# Altium schematic sheet STM32智能储物柜.SchDoc
size A4
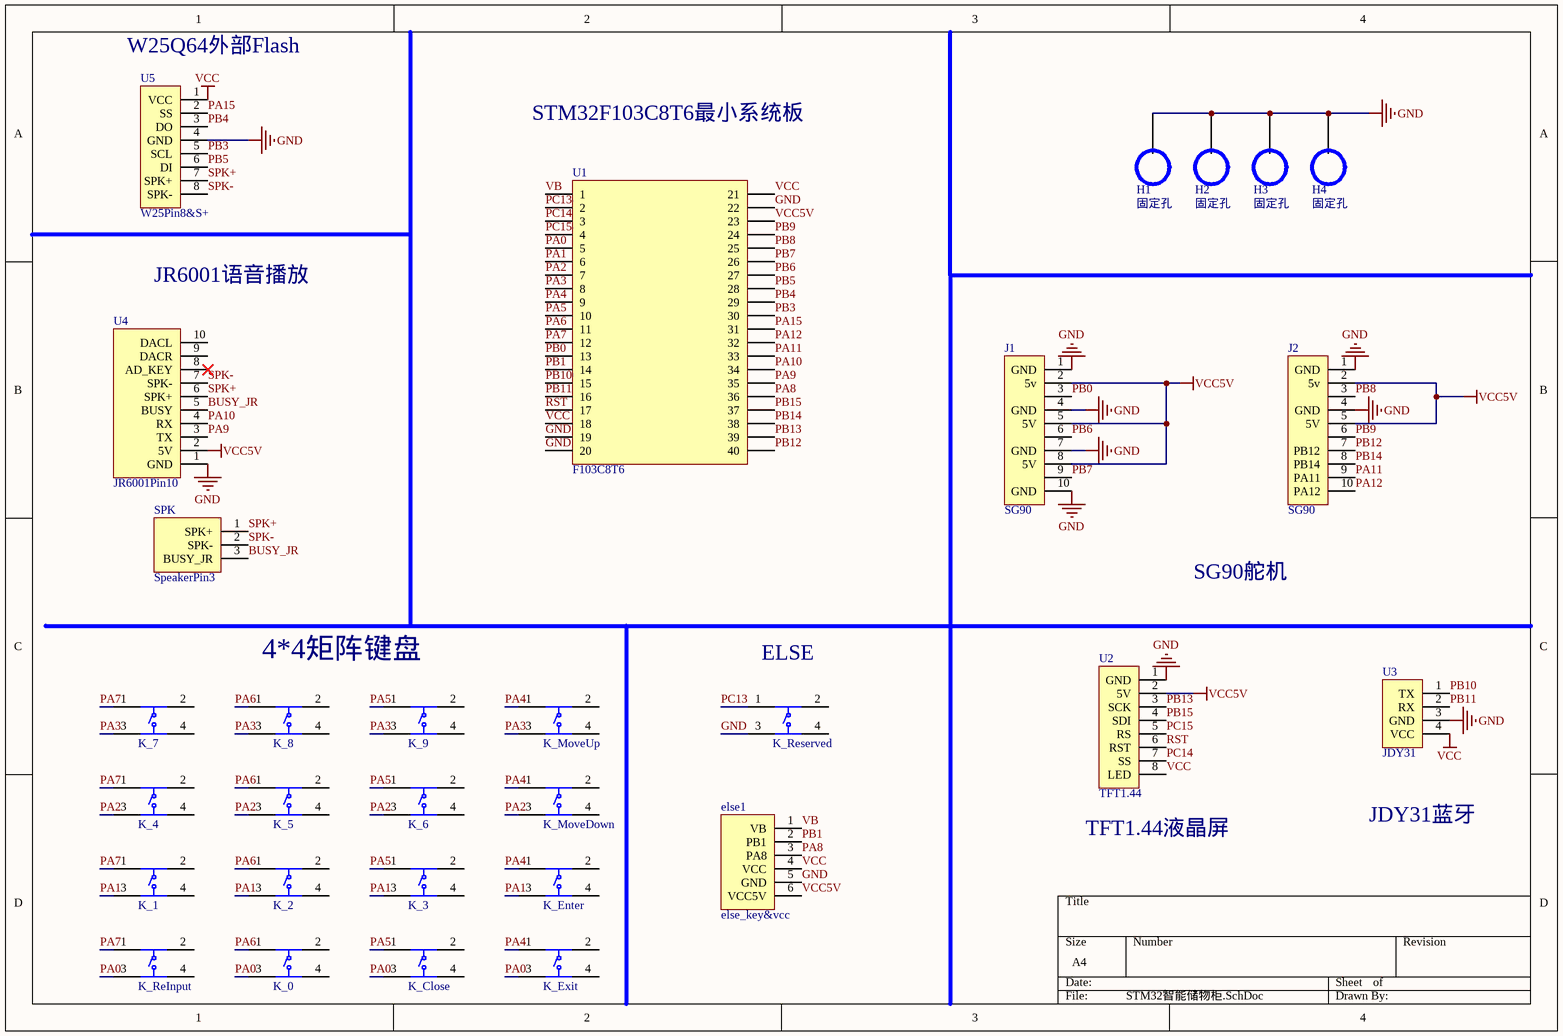
[diagram p0: STM32智能储物柜.SchDoc]

## Parts
else1  else_key&vcc  [else2*3Pin]
H1  固定孔  [铜柱孔]
H2  固定孔  [铜柱孔]
H3  固定孔  [铜柱孔]
H4  固定孔  [铜柱孔]
J1  SG90  [SG90*3+1]
J2  SG90  [SG90*2+4]
K_0  TS665CJ  [SW-TH_4P-L6.0-W6.0-P4.50-LS6.5]  (value not drawn)
K_1  TS665CJ  [SW-TH_4P-L6.0-W6.0-P4.50-LS6.5]  (value not drawn)
K_2  TS665CJ  [SW-TH_4P-L6.0-W6.0-P4.50-LS6.5]  (value not drawn)
K_3  TS665CJ  [SW-TH_4P-L6.0-W6.0-P4.50-LS6.5]  (value not drawn)
K_4  TS665CJ  [SW-TH_4P-L6.0-W6.0-P4.50-LS6.5]  (value not drawn)
K_5  TS665CJ  [SW-TH_4P-L6.0-W6.0-P4.50-LS6.5]  (value not drawn)
K_6  TS665CJ  [SW-TH_4P-L6.0-W6.0-P4.50-LS6.5]  (value not drawn)
K_7  TS665CJ  [SW-TH_4P-L6.0-W6.0-P4.50-LS6.5]  (value not drawn)
K_8  TS665CJ  [SW-TH_4P-L6.0-W6.0-P4.50-LS6.5]  (value not drawn)
K_9  TS665CJ  [SW-TH_4P-L6.0-W6.0-P4.50-LS6.5]  (value not drawn)
K_Close  TS665CJ  [SW-TH_4P-L6.0-W6.0-P4.50-LS6.5]  (value not drawn)
K_Enter  TS665CJ  [SW-TH_4P-L6.0-W6.0-P4.50-LS6.5]  (value not drawn)
K_Exit  TS665CJ  [SW-TH_4P-L6.0-W6.0-P4.50-LS6.5]  (value not drawn)
K_MoveDown  TS665CJ  [SW-TH_4P-L6.0-W6.0-P4.50-LS6.5]  (value not drawn)
K_MoveUp  TS665CJ  [SW-TH_4P-L6.0-W6.0-P4.50-LS6.5]  (value not drawn)
K_ReInput  TS665CJ  [SW-TH_4P-L6.0-W6.0-P4.50-LS6.5]  (value not drawn)
K_Reserved  TS665CJ  [SW-TH_4P-L6.0-W6.0-P4.50-LS6.5]  (value not drawn)
SPK  SpeakerPin3  [SpeakerPin3]
U1  F103C8T6  [HDR2X20]
U2  TFT1.44  [TFTPin8]
U3  JDY31  [4PinJDY31]
U4  JR6001Pin10  [JR6001Pin10]
U5  W25Pin8&S+  [W25Pin8&S+]

## Nets
GND: else1.5(GND) H1.11 H2.11 H3.11 H4.11 J1.1(GND) J1.4(GND) J1.7(GND) J1.10(GND) J2.1(GND) J2.4(GND) K_Reserved.3 U1.19 U1.20 U1.22 U2.1(GND) U3.3(GND) U4.1(GND) U5.4(GND)
VCC: else1.4(VCC) U1.18 U1.21 U2.8(LED) U3.4(VCC) U5.1(VCC)
VCC5V: else1.6(VCC5V) J1.2(5v) J1.5(5V) J1.8(5V) J2.2(5v) J2.5(5V) U1.23 U2.2(5V) U4.2(5V)
BUSY_JR: SPK.3(BUSY_JR) U4.5(BUSY)
PA0: K_0.3 K_Close.3 K_Exit.3 K_ReInput.3 U1.5
PA1: K_1.3 K_2.3 K_3.3 K_Enter.3 U1.6
PA2: K_4.3 K_5.3 K_6.3 K_MoveDown.3 U1.7
PA3: K_7.3 K_8.3 K_9.3 K_MoveUp.3 U1.8
PA4: K_Enter.1 K_Exit.1 K_MoveDown.1 K_MoveUp.1 U1.9
PA5: K_3.1 K_6.1 K_9.1 K_Close.1 U1.10
PA6: K_0.1 K_2.1 K_5.1 K_8.1 U1.11
PA7: K_1.1 K_4.1 K_7.1 K_ReInput.1 U1.12
PA8: else1.3(PA8) U1.36
PA9: U1.35 U4.3(TX)
PA10: U1.34 U4.4(RX)
PA11: J2.9(PA11) U1.33
PA12: J2.10(PA12) U1.32
PA15: U1.31 U5.2(SS)
PB0: J1.3 U1.13
PB1: else1.2(PB1) U1.14
PB3: U1.30 U5.5(SCL)
PB4: U1.29 U5.3(DO)
PB5: U1.28 U5.6(DI)
PB6: J1.6 U1.27
PB7: J1.9 U1.26
PB8: J2.3 U1.25
PB9: J2.6 U1.24
PB10: U1.15 U3.1(TX)
PB11: U1.16 U3.2(RX)
PB12: J2.7(PB12) U1.40
PB13: U1.39 U2.3(SCK)
PB14: J2.8(PB14) U1.38
PB15: U1.37 U2.4(SDI)
PC13: K_Reserved.1 U1.2
PC14: U1.3 U2.7(SS)
PC15: U1.4 U2.5(RS)
RST: U1.17 U2.6(RST)
SPK+: SPK.1(SPK+) U4.6(SPK+) U5.7(SPK+)
SPK-: SPK.2(SPK-) U4.7(SPK-) U5.8(SPK-)
VB: else1.1(VB) U1.1

Not connected (* = marked no-connect by the designer): K_0 2 4; K_1 2 4; K_2 2 4; K_3 2 4; K_4 2 4; K_5 2 4; K_6 2 4; K_7 2 4; K_8 2 4; K_9 2 4; K_Close 2 4; K_Enter 2 4; K_Exit 2 4; K_MoveDown 2 4; K_MoveUp 2 4; K_ReInput 2 4; K_Reserved 2 4; U4 8(AD_KEY)* 9(DACR) 10(DACL)

## Notes on the sheet
- (near U5) W25Q64外部Flash
- STM32F103C8T6最小系统板
- JR6001语音播放
- SG90舵机
- 4*4矩阵键盘
- (near K_Reserved) ELSE
- (near U2) TFT1.44液晶屏
- JDY31蓝牙

## Library data of the parts
J1 = SG90_1: 舵机
J2 = SG90_2: 舵机
K_0-K_9 K_Close K_Enter K_Exit K_MoveDown K_MoveUp K_ReInput K_Reserved = TS665CJ: 矩阵按键
SPK = SpeakerPin3: 喇叭
U1 = Header2*20: 主控电路; LatestRevisionDate: 17-Jul-2002; LatestRevisionNote: Re-released for DXP Platform.; Publisher: Altium Limited
U2 = TFTPin8: TFT液晶屏
U3 = 4Pin
U4 = JR6001Pin10: 语音
U5 = W25Pin8&S+: FLASH